# Altium project BPC_PWR_v1.1.PrjPcb (part 4 of 4)
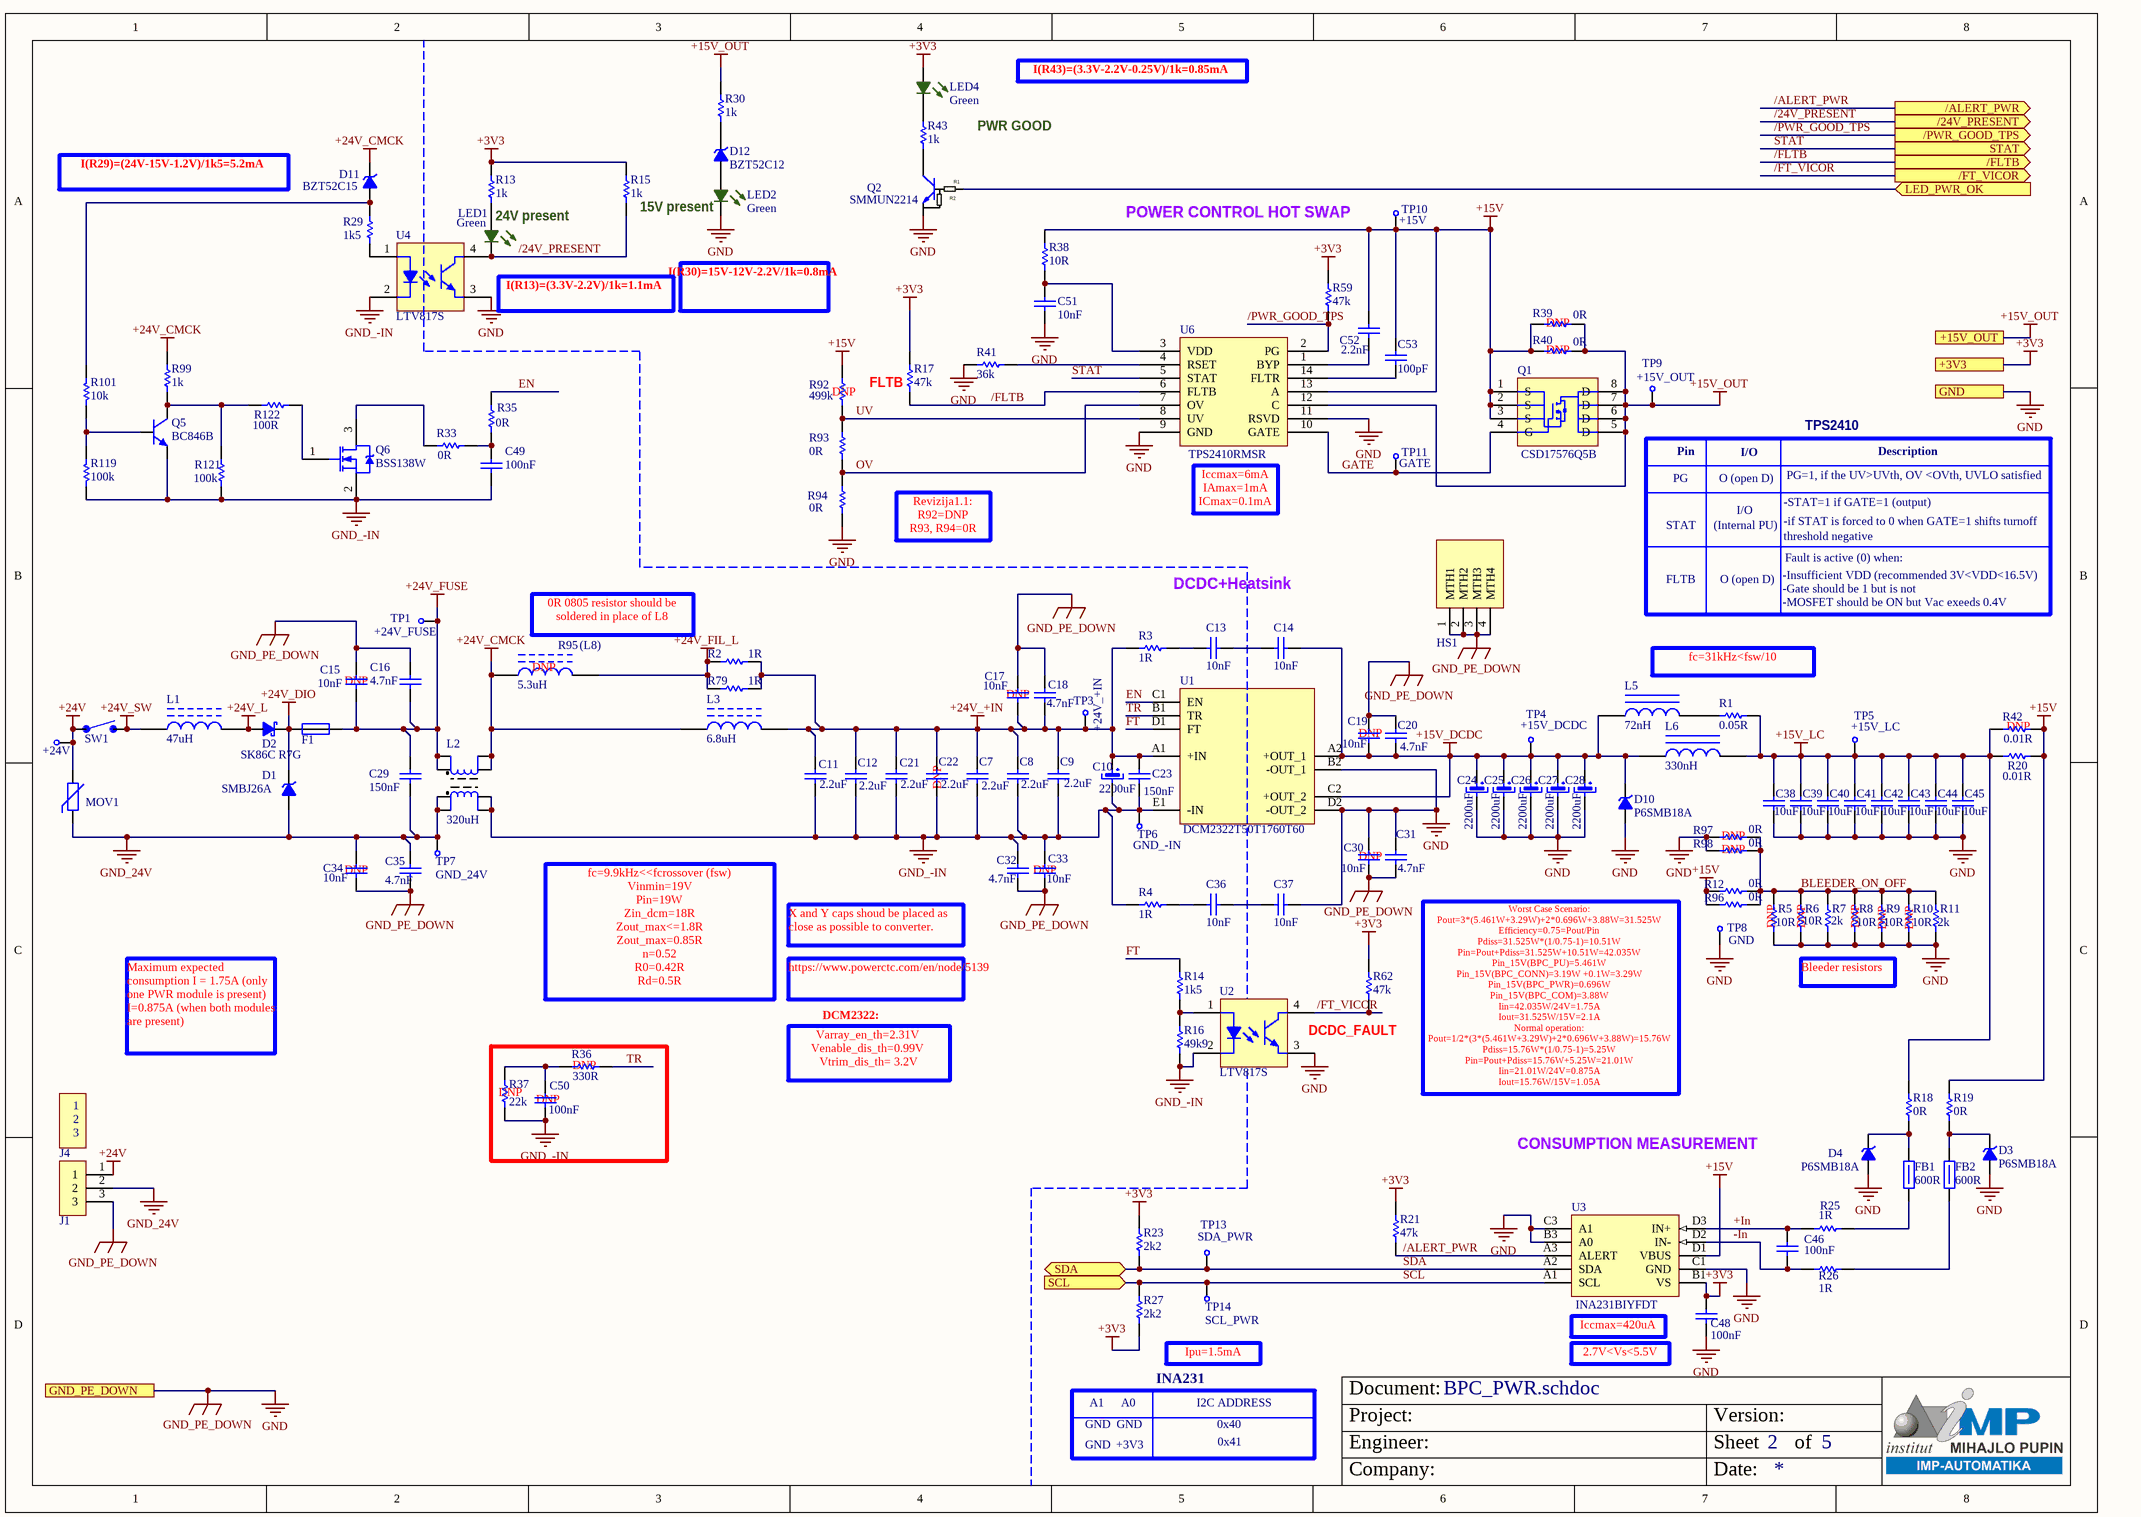
[diagram p7: BPC_PWR.schdoc]

## Sheet BPC_PWR.schdoc: Eurocard VME 6U (9.187 x 6.299 inches) (continued)

### Library data of the parts (continued)
SW1 = El-Mech Switch DF52J12P215HQA MS: Rocker Switch 16A 125V; Manufacturer: C&K; Rated Current: 10AAC, 6ADC; Rated Voltage: 250VAC, 48VDC; Production Status: Active; Distributor: Digi-Key; Distributor Part Number: CKN11830-ND; Manufacturer Part Number: DF52J12P215HQA; Last Revision Date: 01.10.2021; Mounting: Panel mount; ComponentLink1Description: Datasheet; ComponentLink1URL: https://www.ckswitches.com/media/1443/df.pdf; ComponentLink2Description: Distributor; ComponentLink2URL: https://www.digikey.com/en/products/detail/c-k/DF52J12P215HQA/3752604; ComponentLink3Description: Manufacturer; ComponentLink3URL: https://www.ckswitches.com/products/switches/product-details/Rocker/DF/DF52J12P215HQA/; Status: Not Checked; DB Parameter 1: 250VAC, 48VDC; DB Parameter 2: 10AAC, 6ADC
U1 = DC/DC 24V:15V 50W DCM2322T50T1760T60 MS: Isolated Module DC DC Converter 1 Output 15V  4A  9V - 50V Input; Manufacturer: Vicor Corporation; Input Voltage: 9V ~ 50V; Production Status: Active; Isolation: 3V; Distributor: Digi-Key; Distributor Part Number: 1102-DCM2322T50T1760T60-ND; Last Revision Date: 09.03.2021; Temperature Range: -40°C ~ +125°C; Mounting: TH; ComponentLink1Description: Datasheet; ComponentLink1URL: http://www.vicorpower.com/documents/datasheets/DCM2322x50T1760y6z_ds.pdf; ComponentLink2Description: Distributor; ComponentLink2URL: https://www.digikey.com/en/products/detail/vicor-corporation/DCM2322T50T1760T60/10413813; ComponentLink3Description: Manufacturer; ComponentLink3URL: http://www.vicorpower.com/products?productType=cfg&productKey=DCM2322T50T1760T60; Status: Not Checked; Output Voltage: 15V; DB Parameter 1: DCM2322T50T1760T60; DB Parameter 2: 4A; DB Parameter 3: 15V; Output Current: 4A; Manufacturer Part Number: DCM2322T50T1760T60
U2 U4 = IC LTV817S: Optocoupler 5KV Transistor 4-SMD; Manufacturer: Lite-On Inc.; Manufacturer Part Number: LTV-817S; Isolation Voltage: 5000 Vrms; Forward Voltage: 1.2V; Max Forward Current: 50mA; Max Output Voltage: 35V; DB Parameter 3: 4us; Production status: Active; Distributor: Digi-Key; Distributor Part Number: 160-1367-5-ND; Last Revision Date: 17.03.2021; Temperature Range: -30°C ~ +110°C; Mounting: SMD; ComponentLink1Description: Datasheet; ComponentLink1URL: https://optoelectronics.liteon.com/upload/download/DS-70-96-0016/LTV-8X7%20series%20201610%20.pdf; ComponentLink2Description: Distributor; ComponentLink2URL: https://www.digikey.com/en/products/detail/lite-on-inc/LTV-817S/385837; ComponentLink3Description: Manufacturer; ComponentLink3URL: https://optoelectronics.liteon.com/upload/download/DS-70-96-0016/LTV-8X7%20series%20201610%20.pdf; Status: Not Checked; DB Parameter 1: 1.2V; DB Parameter 2: 5000 Vrms; Rise/Fall time: 4us
U3 = IC INA231BIYFDT MS: IC MONITOR PWR/CURR BIDIR 10MSOP; Manufacturer: Texas Instruments; Power Supply: 2.7V ~ 5.5V; DB Parameter 1: 0V ~ 36V; Production Status: Active; Sense Voltage: 0V ~ 25V; Distributor: Mouser; Distributor Part Number: 595-INA231BIYFDT; Last Revision Date: 26.07.2021; Temperature Range: -40°C ~ +125°C; Mounting: SMD; ComponentLink1Description: Datasheet; ComponentLink1URL: https://www.ti.com/lit/ds/symlink/ina231.pdf?HQS=dis-mous-null-mousermode-dsf-pf-null-wwe&DCM=yes&ref_url=https%3A%2F%2Feu.mouser.com%2F&distId=26; ComponentLink2Description: Distributor; ComponentLink2URL: https://eu.mouser.com/ProductDetail/Texas-Instruments/INA231BIYFDT?qs=%2Fha2pyFadui7MHIC05DHFvKEuHw3A34T1OGTYifc7galKUOlGM%2FqWQ%3D%3D; ComponentLink3Description: Manufacturer; ComponentLink3URL: https://www.ti.com/product/INA231?keyMatch=INA231BIYFDT&tisearch=search-everything; Status: Not Checked; Manufacturer Part Number: INA231BIYFDT
U6 = IC TPS2410RMSR MS: IC OR CTRLR N+1 UQFN; Manufacturer: Texas Instruments; Power Supply: 3V~16.5V; Production Status: Active; Distributor: Mouser; Distributor Part Number: 595-TPS2410RMSR; Last Revision Date: 26.07.2021; Temperature Range: -40°C ~ +85°C; Mounting: SMD; ComponentLink1Description: Datasheet; ComponentLink1URL: https://www.ti.com/lit/ds/symlink/tps2410.pdf?ts=1627292155251&ref_url=https%253A%252F%252Fwww.ti.com%252Fproduct%252FTPS2410; ComponentLink2Description: Distributor; ComponentLink2URL: https://eu.mouser.com/ProductDetail/Texas-Instruments/TPS2410RMSR?qs=d0WKAl%252BL4KZPBEcdojYg8Q%3D%3D; ComponentLink3Description: Manufacturer; ComponentLink3URL: https://www.ti.com/product/TPS2410?keyMatch=TPS2410&tisearch=search-everything; Status: Not Checked; DB Parameter 1: TPS2410RMSR; DB Parameter 2: 3V~16.5V; Manufacturer Part Number: TPS2410RMSR

## Sheet BPC_PWR_CONN.schdoc: Eurocard VME 6U (9.187 x 6.299 inches)
size A3; Organization: Organization; Address1: Address1; Address2: Address2; Address3: Address3; Address4: Address4; DocumentNumber: 1; Revision: 0; SheetNumber: 3; SheetTotal: 5
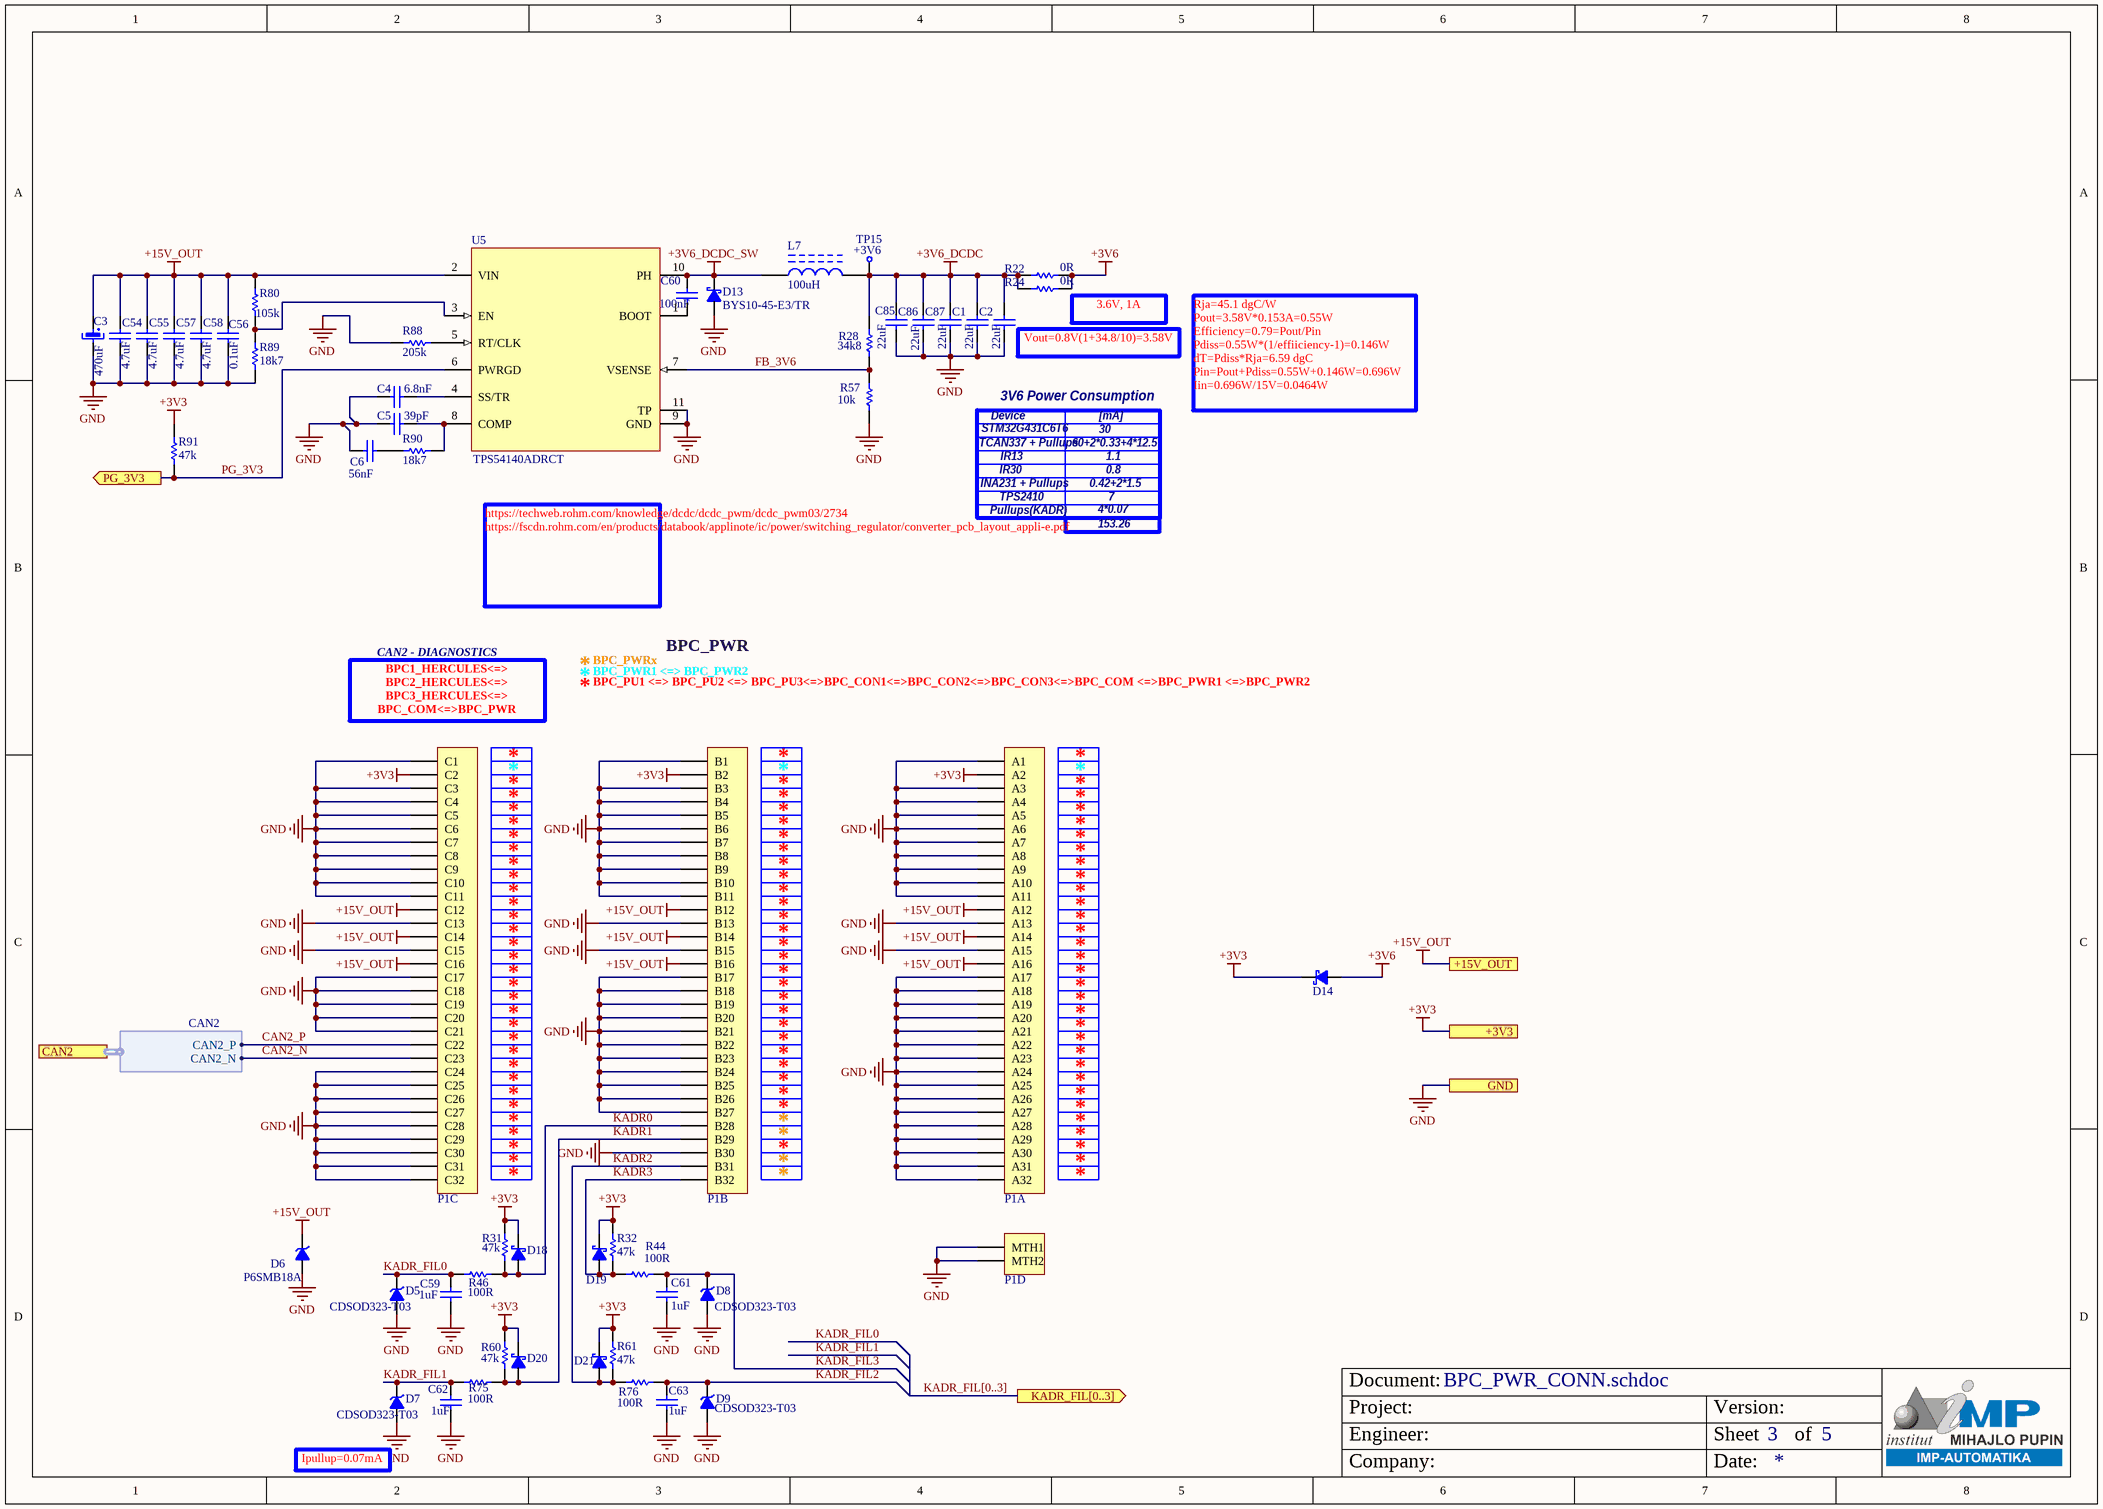
[diagram p4: BPC_PWR_CONN.schdoc]

### Parts
C1  DB Parameter 1: 22uF  [1206 C 1.80mm MS]  (hidden comment: Ceramic Capacitor)
C2  DB Parameter 1: 22uF  [1206 C 1.80mm MS]  (hidden comment: Ceramic Capacitor)
C3  Capacitance: 470uF  [Electrolytic Cap SMD 10x10mm Wuerth MS]  (hidden comment: Electorlytic Capacitor)
C4  Capacitance: 6.8nF  [C0603L 0.8 MM MS]  (hidden comment: Ceramic Capacitor)
C5  DB Parameter 1: 39pF  [C0603L 0.8 MM MS]  (hidden comment: Ceramic Capacitor)
C6  Capacitance: 56nF  [C0603L 0.8 MM MS]  (hidden comment: Ceramic Capacitor)
C54  DB Parameter 1: 4.7uF  [1210 C 1.80mm MS]  (hidden comment: Ceramic Capacitor)
C55  DB Parameter 1: 4.7uF  [1210 C 1.80mm MS]  (hidden comment: Ceramic Capacitor)
C56  Capacitance: 0.1uF  [0805 C 1.27mm MS]  (hidden comment: Ceramic Capacitor)
C57  DB Parameter 1: 4.7uF  [1210 C 1.80mm MS]  (hidden comment: Ceramic Capacitor)
C58  DB Parameter 1: 4.7uF  [1210 C 1.80mm MS]  (hidden comment: Ceramic Capacitor)
C59  Capacitance: 1uF  [C0603L 0.8 MM MS]  (hidden comment: Ceramic Capacitor)
C60  Capacitance: 100nF  [C0603L 0.8 MM MS]  (hidden comment: Ceramic Capacitor)
C61  Capacitance: 1uF  [C0603L 0.8 MM MS]  (hidden comment: Ceramic Capacitor)
C62  Capacitance: 1uF  [C0603L 0.8 MM MS]  (hidden comment: Ceramic Capacitor)
C63  Capacitance: 1uF  [C0603L 0.8 MM MS]  (hidden comment: Ceramic Capacitor)
C85  DB Parameter 1: 22uF  [1206 C 1.80mm MS]  (hidden comment: Ceramic Capacitor)
C86  DB Parameter 1: 22uF  [1206 C 1.80mm MS]  (hidden comment: Ceramic Capacitor)
C87  DB Parameter 1: 22uF  [1206 C 1.80mm MS]  (hidden comment: Ceramic Capacitor)
D5  CDSOD323-T03  [SOD2513X114N]
D6  P6SMB18A  [DO-214AA SMB MS]
D7  CDSOD323-T03  [SOD2513X114N]
D8  CDSOD323-T03  [SOD2513X114N]
D9  CDSOD323-T03  [SOD2513X114N]
D13  BYS10-45-E3/TR  [DO-214AC SMA MS]
D14  PMEG3010ER,115  [SODFL3517X110N MS]  (value not drawn)
D18  PMEG3010ER,115  [SODFL3517X110N MS]  (value not drawn)
D19  PMEG3010ER,115  [SODFL3517X110N MS]  (value not drawn)
D20  PMEG3010ER,115  [SODFL3517X110N MS]  (value not drawn)
D21  PMEG3010ER,115  [SODFL3517X110N MS]  (value not drawn)
L7  Inductance: 100uH  [INDPM120120X1020N MS]  (hidden comment: Inductor)
P1  DIN 41612  [DIN 41612 96-pin Male Angled ABC MS]  (value not drawn)  (parts A,B,C,D of 4)
R22  Resistance: 0R  [R0603L 0.45MM MS]  (hidden comment: Resistor)
R24  Resistance: 0R  [R0603L 0.45MM MS]  (hidden comment: Resistor)
R28  Resistance: 34k8  [R0603L 0.45MM MS]  (hidden comment: Resistor)
R31  Resistance: 47k  [R0603L 0.45MM MS]  (hidden comment: Resistor)
R32  Resistance: 47k  [R0603L 0.45MM MS]  (hidden comment: Resistor)
R44  Resistance: 100R  [R0603L 0.45MM MS]  (hidden comment: Resistor)
R46  Resistance: 100R  [R0603L 0.45MM MS]  (hidden comment: Resistor)
R57  Resistance: 10k  [R0603L 0.45MM MS]  (hidden comment: Resistor)
R60  Resistance: 47k  [R0603L 0.45MM MS]  (hidden comment: Resistor)
R61  Resistance: 47k  [R0603L 0.45MM MS]  (hidden comment: Resistor)
R75  Resistance: 100R  [R0603L 0.45MM MS]  (hidden comment: Resistor)
R76  Resistance: 100R  [R0603L 0.45MM MS]  (hidden comment: Resistor)
R80  Resistance: 105k  [R0603L 0.45MM MS]  (hidden comment: Resistor)
R88  Resistance: 205k  [R0603L 0.45MM MS]  (hidden comment: Resistor)
R89  Resistance: 18k7  [R0603L 0.45MM MS]  (hidden comment: Resistor)
R90  Resistance: 18k7  [R0603L 0.45MM MS]  (hidden comment: Resistor)
R91  Resistance: 47k  [R0603L 0.45MM MS]  (hidden comment: Resistor)
TP15  +3V6  [TP SMD 1.2mm MS]  (no BOM)
U5  TPS54140ADRCT  [DRC10_2P4X1P65_TEX MS]

### Ports
+3V3, +15V_OUT, CAN2 (harness CAN2), GND, KADR_FIL[0..3] (out), PG_3V3 (out)

### Harnesses
CAN2: CAN2_N, CAN2_P

### Nets
+3V3: D14.1(K) D18.1(K) D19.1(K) D20.1(K) D21.1(K) P1.A2 P1.B2 P1.C2 R31.2 R32.2 R60.2 R61.2 R91.2 ; port +3V3
+3V6: D14.2(A) R22.1 R24.1
+3V6_DCDC: C1.1 C2.1 C85.1 C86.1 C87.1 L7.2 R22.2 R24.2 R28.2 TP15.1
+3V6_DCDC_SW: C60.1 D13.1(K) L7.1 U5.10(PH)
+15V_OUT: C3.1 C54.1 C55.1 C56.1 C57.1 C58.1 D6.K P1.A12 P1.A14 P1.A16 P1.B12 P1.B14 P1.B16 P1.C12 P1.C14 P1.C16 R80.2 U5.2(VIN) ; port +15V_OUT
GND: C1.2 C2.2 C3.2 C4.1 C5.1 C6.1 C54.2 C55.2 C56.2 C57.2 C58.2 C59.1 C61.1 C62.2 C63.2 C85.2 C86.2 C87.2 D5.A D6.A D7.A D8.A D9.A D13.2(A) P1.97(MTH1) P1.98(MTH2) P1.A1 P1.A3 P1.A4 P1.A5 P1.A6 P1.A7 P1.A8 P1.A9 P1.A10 P1.A11 P1.A13 P1.A15 P1.A17 P1.A18 P1.A19 P1.A20 P1.A21 P1.A22 P1.A23 P1.A24 P1.A25 P1.A26 P1.A27 P1.A28 P1.A29 P1.A30 P1.A31 P1.A32 P1.B1 P1.B3 P1.B4 P1.B5 P1.B6 P1.B7 P1.B8 P1.B9 P1.B10 P1.B11 P1.B13 P1.B15 P1.B17 P1.B18 P1.B19 P1.B20 P1.B21 P1.B22 P1.B23 P1.B24 P1.B25 P1.B26 P1.B27 P1.B30 P1.C1 P1.C3 P1.C4 P1.C5 P1.C6 P1.C7 P1.C8 P1.C9 P1.C10 P1.C11 P1.C13 P1.C15 P1.C17 P1.C18 P1.C19 P1.C20 P1.C21 P1.C24 P1.C25 P1.C26 P1.C27 P1.C28 P1.C29 P1.C30 P1.C31 P1.C32 R57.2 R88.1 R89.2 U5.9(GND) U5.11(TP) ; port GND
CAN2_N: P1.C23 ; port CAN2.CAN2_N
CAN2_P: P1.C22 ; port CAN2.CAN2_P
FB_3V6: R28.1 R57.1 U5.7(VSENSE)
KADR0: D18.2(A) P1.B28 R31.1 R46.2
KADR1: D20.2(A) P1.B29 R60.1 R75.2
KADR2: D21.2(A) P1.B31 R61.1 R76.1
KADR3: D19.2(A) P1.B32 R32.1 R44.1
KADR_FIL0: C59.2 D5.K R46.1
KADR_FIL1: C62.1 D7.K R75.1
KADR_FIL2: C63.1 D9.K R76.2
KADR_FIL3: C61.2 D8.K R44.2
PG_3V3: R91.1 U5.6(PWRGD) ; port PG_3V3
NetC4_2: C4.2 U5.4(SS/TR)
NetC5_2: C5.2 R90.1 U5.8(COMP)
NetC6_2: C6.2 R90.2
NetC60_2: C60.2 U5.1(BOOT)
NetR80_1: R80.1 R89.1 U5.3(EN)
NetR88_2: R88.2 U5.5(RT/CLK)

### Buses and harness runs
bus KADR_FIL[0..3] = port KADR_FIL[0..3]

### Notes on the sheet
- 3.6V, 1A
- (near C2) Vout=0.8V(1+34.8/10)=3.58V
- TCAN337 + Pullups
- STM32G431C6T6
- Device
- 3V6 Power Consumption
- 60+2*0.33+4*12.5
- [mA]
- 30
- Rja=45.1 dgC/W
  Pout=3.58V*0.153A=0.55W
  Efficiency=0.79=Pout/Pin
  Pdiss=0.55W*(1/effiiciency-1)=0.146W
  dT=Pdiss*Rja=6.59 dgC
  Pin=Pout+Pdiss=0.55W+0.146W=0.696W
  Iin=0.696W/15V=0.0464W
- INA231 + Pullups
- Pullups(KADR)
- IR30
- TPS2410
- IR13
- 0.42+2*1.5
- 4*0.07
- 1.1
- 0.8
- 7
- 153.26
- https://techweb.rohm.com/knowledge/dcdc/dcdc_pwm/dcdc_pwm03/2734
  https://fscdn.rohm.com/en/products/databook/applinote/ic/power/switching_regulator/converter_pcb_layout_appli-e.pdf
- BPC_PWR
- (near P1) BPC1_HERCULES<=>
  BPC2_HERCULES<=>
  BPC3_HERCULES<=>
  BPC_COM<=>BPC_PWR
  BPC2<=>BPC3<=>BPC_COM<=> BPC_PWR
- CAN2 - DIAGNOSTICS
- *
- BPC_PWR1 <=> BPC_PWR2
- BPC_PU1 <=> BPC_PU2 <=> BPC_PU3<=>BPC_CON1<=>BPC_CON2<=>BPC_CON3<=>BPC_COM <=>BPC_PWR1 <=>BPC_PWR2
- BPC_PWRx
- (near D7) Ipullup=0.07mA
- Document:
- Project:
- Engineer:
- Version:
- Sheet
- of
- Company:
- Date:

### Library data of the parts
C1 C2 C85-C87 = Cap Cer 22uF 10V X7R 1206 MS: Ceramic Capacitor 22UF 10V X7R 1206; Manufacturer: Samsung Electro-Mechanics; Manufacturer Part Number: CL31B226MPHNNNE; Tolerance: ±20%; Production Status: Active; Distributor: Digi-Key; Distributor Part Number: 1276-3148-1-ND; Last Revision Date: 07.04.2021; Temperature Range: -55°C ~ +125°C; Mounting: SMD; ComponentLink1Description: Datasheet; ComponentLink1URL: http://weblib.samsungsem.com/mlcc/mlcc-ec-data-sheet.do?partNumber=CL31B226MPHNNN; ComponentLink2Description: Distributor; ComponentLink2URL: https://www.digikey.com/en/products/detail/samsung-electro-mechanics/CL31B226MPHNNNE/3888806; ComponentLink3Description: Manufacturer; ComponentLink3URL: http://product.samsungsem.com/mlcc/basic-search.do?partNumber=CL31B226MPHNNN; Status: Not Checked; Voltage: 10V; Dielectric: X7R; ComponentLink4Description: Charts; ComponentLink4URL: http://weblib.samsungsem.com/mlcc/mlcc-ec-data-sheet.do?partNumber=CL31B226MPHNNN; Capacitance: 22uF; DB Parameter 2: 10V; DB Parameter 3: X7R
C3 = Cap El 470uF 25V 10x10mm Nichicon MS: Electrolytic Capacitor 470uF 25V 10x10mm; Manufacturer Part Number: UCL1E471MNL1GS; Tolerance: ±20%; ESR: 60mOhm; Ripple Current: 1.19A @ 120KHz; Production Status: Active; Distributor: Digi-Key; Distributor Part Number: 493-3944-1-ND; Manufacturer: Nichicon; Last Revision Date: 18.10.2021; Temperature Range: -55°C ~ +105°C; Part ID: https://products.nichicon.co.jp/en/product_detail.cfm; Mounting: SMD; ComponentLink1Description: Datasheet; ComponentLink1URL: https://www.nichicon.co.jp/english/products/pdfs/e-ucl.pdf; ComponentLink2Description: Distributor; ComponentLink2URL: https://www.digikey.com/en/products/detail/nichicon/UCL1E471MNL1GS/2300293; ComponentLink3Description: Manufacturer; Status: Not Checked; Voltage: 25V; DB Parameter 1: 470uF; DB Parameter 2: 25V; DB Parameter 3: 60mOhm
C4 = Cap Cer 6.8nF 50V X7R 0603 MS: Ceramic Capacitor 6.8nF 50V X7R 0603; Manufacturer: Samsung Electro-Mechanics; Manufacturer Part Number: CL10B682KB8WPNC; Tolerance: ±10%; Distributor: Mouser; Distributor Part Number: 187-CL10B682KB8WPNC; Last Revision Date: 16.11.2021; Temperature Range: -55°C ~ +125°C; Mounting: SMD; ComponentLink1Description: Datasheet; ComponentLink1URL: http://weblib.samsungsem.com/mlcc/mlcc-ec-data-sheet.do?partNumber=CL10B682KB8WPN; ComponentLink2Description: Distributor; ComponentLink2URL: https://eu.mouser.com/ProductDetail/Samsung-Electro-Mechanics/CL10B682KB8WPNC?qs=%2Fha2pyFadug1twFwk2Wnk2Vt7E8v7A45fe06n%2FQrFB9HdtGBEQp1bw%3D%3D; ComponentLink3Description: Manufacturer; ComponentLink3URL: http://product.samsungsem.com/mlcc/CL10B682KB8WPN.do; Status: Not Checked; Voltage: 50V; Dielectric: X7R; ComponentLink4Description: Charts; ComponentLink4URL: http://weblib.samsungsem.com/mlcc/mlcc-ec-data-sheet.do?partNumber=CL10B682KB8WPN; DB Parameter 1: 6.8nF; DB Parameter 2: 50V; DB Parameter 3: X7R
C5 = Cap Cer 39pF 50V C0G_NP0 0603: Ceramic Capacitor 39pF 50V C0G_NP0 0603; Manufacturer: Yageo; Manufacturer Part Number: CC0603JRNPO9BN390; Tolerance: ±5%; Production Status: Active; Distributor: Mouser; Distributor Part Number: 603-CC603JRNPO9BN390; Last Revision Date: 02.12.2021; Temperature Range: -55°C ~ +125°C; Mounting: SMD; ComponentLink1Description: Datasheet; ComponentLink1URL: https://www.yageo.com/upload/media/product/productsearch/datasheet/mlcc/UPY-GP_NP0_16V-to-50V_18.pdf; ComponentLink2Description: Distributor; ComponentLink2URL: https://eu.mouser.com/ProductDetail/YAGEO/CC0603JRNPO9BN390?qs=T%2F3nPWKqOSYu51Zx7Vtd2Q%3D%3D; ComponentLink3Description: Manufacturer; ComponentLink3URL: https://www.yageo.com/en/ProductSearch/PartNumberSearch?part_number=CC0603JRNPO9BN390; Status: Not Checked; Voltage: 50V; Dielectric: C0G_NP0; ComponentLink4Description: Charts; ComponentLink4URL: https://www.yageo.com/en/Chart/Index/CC0603JRNPO9BN390; Capacitance: 39pF; DB Parameter 2: 50V; DB Parameter 3: C0G_NP0
C6 = Cap Cer 56nF 50V X7R 0603 MS: Ceramic Capacitor 56nF 50V X7R 0603; Manufacturer: Yageo; Manufacturer Part Number: CC0603KRX7R9BB563; Tolerance: ±10%; Production Status: Active; Distributor: Mouser; Distributor Part Number: 603-CC603KRX7R9BB563; Last Revision Date: 12.02.2021; Temperature Range: -55°C ~ +125°C; Mounting: SMD; ComponentLink1Description: Datasheet; ComponentLink1URL: https://www.yageo.com/upload/media/product/productsearch/datasheet/mlcc/UPY-GPHC_X7R_6.3V-to-50V_20.pdf; ComponentLink2Description: Distributor; ComponentLink2URL: https://eu.mouser.com/ProductDetail/YAGEO/CC0603KRX7R9BB563?qs=57cj7OiSijmLSlNkQYflZA%3D%3D; ComponentLink3Description: Manufacturer; ComponentLink3URL: https://www.yageo.com/en/ProductSearch/PartNumberSearch?part_number=CC0603KRX7R9BB563; Status: Not Checked; Voltage: 50V; Dielectric: X7R; ComponentLink4Description: Charts; ComponentLink4URL: https://www.yageo.com/en/Chart/Index/CC0603KRX7R9BB563; DB Parameter 1: 56nF; DB Parameter 2: 50V; DB Parameter 3: X7R
C54 C55 C57 C58 = Cap Cer 4.7uF 100V X7S 1210 MS: Ceramic Capacitor 4.7uF 100V X7S 1210; Manufacturer: Taiyo Yuden; Manufacturer Part Number: HMK325C7475KN-TE; Tolerance: ±10%; Production Status: Active; Distributor: Digi_Key; Distributor Part Number: 587-5038-1-ND; Last Revision Date: 22.07.2021; Temperature Range: -55°C ~ +125°C; Mounting: SMD; ComponentLink1Description: Datasheet; ComponentLink1URL: https://www.yuden.co.jp/productdata/catalog/mlcc06_e.pdf; ComponentLink2Description: Distributor; ComponentLink2URL: https://www.digikey.com/en/products/detail/taiyo-yuden/HMK325C7475KN-TE/6563631; ComponentLink3Description: Manufacturer; ComponentLink3URL: https://ds.yuden.co.jp/TYCOMPAS/ut/detail?pn=HMK325C7475KN-TE&u=M; Status: Not Checked; Voltage: 100V; Dielectric: X7S; ComponentLink4Description: Charts; ComponentLink4URL: https://ds.yuden.co.jp/TYCOMPAS/ut/detail?pn=HMK325C7475KN-TE&u=M; Capacitance: 4.7uF; DB Parameter 2: 100V; DB Parameter 3: X7S
C56 = Cap Cer 0.1uF 100V X7R 0805 MS: Ceramic Capacitor 0.1uF 100V X7R 0805; Manufacturer: TDK; Manufacturer Part Number: C2012X7R2A104K125AA; Tolerance: ±10%; Production Status: Active; Distributor: Mouser; Distributor Part Number: 810-C2012X7R2A104K; Last Revision Date: 06.12.2021; Temperature Range: -55°C ~ +125°C; Mounting: SMD; ComponentLink1Description: Datasheet; ComponentLink1URL: https://product.tdk.com/system/files/dam/doc/product/capacitor/ceramic/mlcc/catalog/mlcc_commercial_midvoltage_en.pdf; ComponentLink2Description: Distributor; ComponentLink2URL: https://eu.mouser.com/ProductDetail/TDK/C2012X7R2A104K125AA?qs=NRhsANhppD9J0ZsT2%2Fo%2F7Q%3D%3D; ComponentLink3Description: Manufacturer; ComponentLink3URL: https://product.tdk.com/en/search/list#part_no=C2012X7R2A104K125AA&_l=20&_p=1&_c=part_no-part_no&_d=0; Status: Not Checked; Voltage: 100V; Dielectric: X7R; ComponentLink4Description: Charts; ComponentLink4URL: https://product.tdk.com/system/files/dam/doc/product/capacitor/ceramic/mlcc/charasheet/c2012x7r2a104k125aa.pdf; DB Parameter 1: 0.1uF; DB Parameter 2: 100V; DB Parameter 3: X7R
C59 C61-C63 = Cap Cer 1uF 50V X5R 0603 MS: Ceramic Capacitor 1uF 50V X5R 0603; Manufacturer: Taiyo Yuden; Manufacturer Part Number: UMK107BJ105KA-T; Tolerance: ±10%; Production Status: Active; Distributor: Digi-Key; Distributor Part Number: 587-2400-1-ND; Last Revision Date: 07.04.2021; Temperature Range: -55°C ~ +85°C; Mounting: SMD; ComponentLink1Description: Datasheet; ComponentLink1URL: https://ds.yuden.co.jp/TYCOMPAS/ut/detail?pn=UMK107BJ105KA-T%20%20&u=M; ComponentLink2Description: Distributor; ComponentLink2URL: https://www.digikey.com/en/products/detail/taiyo-yuden/UMK107BJ105KA-T/2178919; ComponentLink3Description: Manufacturer; ComponentLink3URL: https://ds.yuden.co.jp/TYCOMPAS/ut/detail?pn=UMK107BJ105KA-T%20%20&u=M; Status: Not Checked; Voltage: 50V; Dielectric: X5R; ComponentLink4Description: Charts; ComponentLink4URL: https://ds.yuden.co.jp/TYCOMPAS/ut/detail?pn=UMK107BJ105KA-T%20%20&u=M; DB Parameter 1: 1uF; DB Parameter 2: 50V; DB Parameter 3: X5R
C60 = Cap Cer 100nF 50V X7R 0603 Pt02: Ceramic Capacitor 100nF 50V X7R 0603; Manufacturer: Samsung Electro-Mechanics; Manufacturer Part Number: CL10B104KB8WPNC; Tolerance: ±10%; Distributor: Mouser; Distributor Part Number: 187-CL10B104KB8WPNC; Last Revision Date: 19.10.2020.; Temperature Range: -55°C ~ +125°C; Mounting: SMD; ComponentLink1Description: Datasheet; ComponentLink1URL: https://eu.mouser.com/datasheet/2/396/mlcc02_e-1307760.pdf; ComponentLink2Description: Distributor; ComponentLink2URL: https://eu.mouser.com/ProductDetail/Taiyo-Yuden/JMK212BJ476MG-T?qs=I6KAKw0tg2zBfYZ1Prs1hQ%3D%3D; ComponentLink3Description: Manufacturer; ComponentLink3URL: https://ds.yuden.co.jp/TYCOMPAS/or/detail?pn=JMK212BBJ476MG-T&u=M; Status: Not Checked; Voltage: 50V; Dielectric: X7R; ComponentLink4Description: Charts; DB Parameter 1: 100nF; DB Parameter 2: 50V; DB Parameter 3: X7R
D5 D7-D9 = Dio TVS Udir 3.3V 19V CDSOD323 MS: TVS Diode 3.3V 19V Udir; Manufacturer: Bourns Inc.; Peak Pulse Power: 350W; Production status: Active; Distributor: Digi-Key; Distributor Part Number: CDSOD323-T03CT-ND; Manufacturer Part Number: CDSOD323-T03; Last Revision Date: 29.03.2021; Temperature Range: -55°C ~ +155°C; Mounting: SMD; ComponentLink1Description: Datasheet; ComponentLink1URL: https://www.bourns.com/docs/Product-Datasheets/CDSOD323-TxxC.pdf; ComponentLink2Description: Distributor; ComponentLink2URL: https://www.digikey.com/en/products/detail/bourns-inc/CDSOD323-T03/3742076; ComponentLink3Description: Manufacturer; ComponentLink3URL: https://www.bourns.com/docs/Product-Datasheets/CDSOD323-TxxC.pdf; Status: Not Checked; Working Voltage: 3.3V; DB Parameter 1: 3.3V; DB Parameter 2: 19V; DB Parameter 3: 350W; Clamping Voltage: 19V
D6 = Dio TVS Udir 15.3V 600W P6SMB18A MS: TVS Diode 15.3V 600W Unidirectional; Manufacturer: Bourns; DB Parameter 2: 25.5V; Production status: Active; Distributor: Digi-Key; Distributor Part Number: P6SMB18ABBCT-ND; Manufacturer Part Number: P6SMB18A; Last Revision Date: 26.03.2021; Temperature Range: -55°C ~ +150°C; Mounting: SMD; ComponentLink1Description: Datasheet; ComponentLink1URL: https://www.bourns.com/docs/Product-Datasheets/P6SMB.pdf; ComponentLink2Description: Distributor; ComponentLink2URL: https://www.digikey.com/en/products/detail/bourns-inc/P6SMB18A/5320280; ComponentLink3Description: Manufacturer; ComponentLink3URL: https://www.bourns.com/docs/Product-Datasheets/P6SMB.pdf; Status: Not Checked; Working Voltage: 15.3V; Peak Pulse Power: 600W; DB Parameter 1: 15.3V; DB Parameter 3: 600W; Clamping Voltage: 25.5V
D13 = Dio Sch 1.5A 45V SMA MS: Schottky Diode 1.5A 45V SMA; Manufacturer: Vishay General Semiconductor; Forward Voltage: 0.5V; Production status: Active; Distributor: Mouser; Distributor Part Number: 625-BYS10-45-E3; Manufacturer Part Number: BYS10-45-E3/TR; Last Revision Date: 16.11.2021; Temperature Range: -65°C ~ +150°C; Mounting: SMD; ComponentLink1Description: Datasheet; ComponentLink1URL: https://eu.mouser.com/datasheet/2/427/VISH_S_A0010476688_1-2571185.pdf; ComponentLink2Description: Distributor; ComponentLink2URL: https://eu.mouser.com/ProductDetail/Vishay/BYS10-45-E3-TR?qs=sGAEpiMZZMuGN2ig0xo6G%252BqK%252BHngrO2%2F; ComponentLink3Description: Manufacturer; ComponentLink3URL: https://www.vishay.com/product?docid=86013; Status: Not Checked; Rated Current: 1.5A; DB Parameter 1: 0.5V; DB Parameter 2: 1.5A; DB Parameter 3: 45V; Forward current: 1.5A
D14 D18-D21 = Dio Sch 1A 30V SOD-123W-2 MS: Schottky Diode 1A 30V SOD-123W-2; Manufacturer: Nexperia; Forward Voltage: 0.32V; Production status: Active; Distributor: Mouser; Distributor Part Number: 771-PMEG3010ER115; Manufacturer Part Number: PMEG3010ER,115; Last Revision Date: 17.08.2021; Temperature Range: -55°C ~ +150°C; Mounting: SMD; ComponentLink1Description: Datasheet; ComponentLink1URL: https://eu.mouser.com/datasheet/2/916/PMEG3010ER-1600158.pdf; ComponentLink2Description: Distributor; ComponentLink2URL: https://eu.mouser.com/ProductDetail/Nexperia/PMEG3010ER115?qs=LMSg3oBIm%2FjofezKw7ztsw%3D%3D; ComponentLink3Description: Manufacturer; ComponentLink3URL: https://www.nexperia.com/products/diodes/automotive-diodes/automotive-schottky-diodes-and-rectifiers/automotive-medium-power-low-vf-schottky-rectifiers-single-200-ma/PMEG3010ER.html; Status: Not Checked; Rated Current: 1A; DB Parameter 1: 0.32V; DB Parameter 2: 1A; DB Parameter 3: 30V; Forward current: 1A
L7 = Ind 100uH 2.4A MSS1210 MS: Inductor 100uH 2.4A 0.125R; Manufacturer: Coilcraft; Manufacturer Part Number: MSS1210-104KED; Tolerance: ±10%; Saturation Current: 3.4A; Core Material: Ferrite; SRF: 3.6MHz; Distributor: Mouser; Distributor Part Number: 994-MSS1210-104KED; Last Revision Date: 02.12.2021; Temperature Range: -40°C ~ +85°C; Mounting: SMD; ComponentLink1Description: Datasheet; ComponentLink1URL: https://eu.mouser.com/datasheet/2/597/mss1210-270677.pdf; ComponentLink2Description: Distributor; ComponentLink2URL: https://eu.mouser.com/ProductDetail/Coilcraft/MSS1210-104KED?qs=zCSbvcPd3pbNwzTgkTyd0g%3D%3D; ComponentLink3Description: Manufacturer; ComponentLink3URL: https://www.coilcraft.com/en-us/products/power/shielded-inductors/ferrite-drum/mss-mos/mss1210/?skuId=5439|7722; Status: Not Checked; DC Resistance: 0.125R; DB Parameter 1: 100uH; DB Parameter 2: 2.4A; DB Parameter 3: 0.125R; Rated Current: 2.4A
P1 = Con DIN 41612 96-pin Male Angled ABC MS: Connector DIN 41612 96-pin Male C-type; Manufacturer: Assmann WSW; Manufacturer Part Number: A-CM96ABCR; Rated Current: 2A; Parameter 1: CM96RW; Production Status: Active; Distributor: Schukat; Distributor Part Number: F5151 CM96RW; Last Revision Date: 02.08.2021; Temperature Range: -55°C ~ +125°C; Mounting: TH; ComponentLink1Description: Datasheet; ComponentLink1URL: https://www.assmann-wsw.com/uploads/datasheets/ASS_5678_CO.pdf; ComponentLink2Description: Distributor; ComponentLink2URL: https://www.schukat.com/schukat/schukat_cms_en.nsf/index/CMSDF15D356B046D53BC1256D550038A9E0?OpenDocument&wg=F5151&kb=CM96RW#CM96RW; ComponentLink3Description: Manufacturer; ComponentLink3URL: https://www.assmann-wsw.com/en/product/a-cm96abcr/; Status: Not Checked; Parameter 2: 2A
R22 R24 = Res 0R 100mW 0603: Resistor  0R 100mW 0603; Manufacturer: Stackpole Electronics Inc; Manufacturer Part Number: RMCF0603ZT0R00; DB Parameter 2: 1A; Production Status: Active; Maximum Current: 2A; Distributor: Digi-Key; Distributor Part Number: RMCF0603ZT0R00CT-ND; Last Revision Date: 20.10.2020.; Temperature Range: -55°C ~ +155°C; Mounting: SMD; ComponentLink1Description: Datasheet; ComponentLink1URL: https://www.seielect.com/catalog/sei-rmcf_rmcp.pdf; ComponentLink2Description: Distributor; ComponentLink2URL: https://www.digikey.com/en/products/detail/stackpole-electronics-inc/RMCF0603ZT0R00/1756908; ComponentLink3Description: Manufacturer; ComponentLink3URL: https://www.seielect.com/; Status: Not Checked; Power Rating: 100mW; DB Parameter 1: 0R; DB Parameter 3: 100mW; Rated Current: 1A
R28 = Res 34k8 1% 100mW 0603 MS: Resistor 34k8 1% 100mW 0603; Manufacturer: Panasonic; Manufacturer Part Number: ERJ-3EKF3482V; Temperature Coefficient: ±100ppm/°C; Production Status: Active; Distributor: Mouser; Distributor Part Number: 667-ERJ-3EKF3482V; Last Revision Date: 17.11.2021; Temperature Range: -55°C ~ +155°C; Mounting: SMD; ComponentLink1Description: Datasheet; ComponentLink1URL: https://eu.mouser.com/datasheet/2/315/AOA0000C304-1149620.pdf; ComponentLink2Description: Distributor; ComponentLink2URL: https://eu.mouser.com/ProductDetail/Panasonic/ERJ-3EKF3482V?qs=MVjVSMjNRMovR8SjCGcl3g%3D%3D; ComponentLink3Description: Manufacturer; ComponentLink3URL: https://na.industrial.panasonic.com/products/resistors/smd-chip-resistors/lineup/chip-resistors/series/57494/model/66687; Status: Not Checked; Power Rating: 100mW; Tolerance: ±1%; DB Parameter 1: 34k8; DB Parameter 2: ±1%; DB Parameter 3: 100mW
R31 R32 R60 R61 R91 = Res 47k 1% 100mW 0603 MS: Resistor 47k 1% 100mW 0603; Manufacturer: Yageo; Manufacturer Part Number: RT0603FRE0747KL; Temperature Coefficient: ±50ppm/°C; Production Status: Active; Distributor: Digi-Key; Distributor Part Number: YAG3355CT-ND; Last Revision Date: 08.06.2021; Temperature Range: -55°C ~ +155°C; Mounting: SMD; ComponentLink1Description: Datasheet; ComponentLink1URL: https://www.yageo.com/upload/media/product/productsearch/datasheet/rchip/PYu-RT_1-to-0.01_RoHS_L_12.pdf; ComponentLink2Description: Distributor; ComponentLink2URL: https://www.digikey.com/en/products/detail/yageo/RT0603FRE0747KL/1075386; ComponentLink3Description: Manufacturer; ComponentLink3URL: https://www.yageo.com/en/ProductSearch/PartNumberSearch?part_number=RT0603FRE0747KL; Status: Not Checked; Power Rating: 100mW; Tolerance: ±1%; DB Parameter 1: 47k; DB Parameter 2: ±1%; DB Parameter 3: 100mW
R44 R46 R75 R76 = Res 100R 1% 100mW 0603 MS Pt02: Resistor 100R 1% 100mW 0603; Manufacturer: Stackpole Electronics Inc; Manufacturer Part Number: RMCF0603FT100R; Temperature Coefficient: 100ppm/°C; Production Status: Active; Distributor: Digi-Key; Distributor Part Number: RMCF0603FT100RCT-ND; Last Revision Date: 26.07.2021; Temperature Range: -55°C ~ +155°C; Mounting: SMD; ComponentLink1Description: Datasheet; ComponentLink1URL: https://www.seielect.com/catalog/sei-rmcf_rmcp.pdf; ComponentLink2Description: Distributor; ComponentLink2URL: https://www.digikey.com/en/products/detail/stackpole-electronics-inc/RMCF0603FT100R/1761113; ComponentLink3Description: Manufacturer; ComponentLink3URL: https://www.seielect.com/catalog/sei-rmcf_rmcp.pdf; Status: Not Checked; Power Rating: 100mW; Tolerance: ±1%; DB Parameter 1: 100R; DB Parameter 2: ±1%; DB Parameter 3: 100mW
R57 = Res 10k 1% 100mW 0603: Resistor 10k 1% 100mW 0603; Manufacturer: Yageo; Manufacturer Part Number: RC0603FR-1310KL; Temperature Coefficient: ±100 PPM/°C; Production Status: Active; Distributor: Digi-Key; Distributor Part Number: 13-RC0603FR-1310KLCT-ND; Last Revision Date: 26.07.2021; Temperature Range: -55°C ~ +155°C; Mounting: SMD; ComponentLink1Description: Datasheet; ComponentLink1URL: https://www.yageo.com/upload/media/product/productsearch/datasheet/rchip/PYu-RC_Group_51_RoHS_L_11.pdf; ComponentLink2Description: Distributor; ComponentLink2URL: https://www.digikey.com/en/products/detail/yageo/RC0603FR-1310KL/12756399; ComponentLink3Description: Manufacturer; ComponentLink3URL: https://www.yageo.com/en/ProductSearch/PartNumberSearch?part_number=RC0603FR-1310KL; Status: Not Checked; Power Rating: 100mW; Tolerance: ±1%
R80 = Res 105k 1% 100mW 0603: Resistor 105k 1% 100mW 0603; Manufacturer: Panasonic; Manufacturer Part Number: ERJ-3EKF1053V; Temperature Coefficient: ±100ppm/°C; Production Status: Active; Distributor: Mouser; Distributor Part Number: 667-ERJ-3EKF1053V; Last Revision Date: 11.16.2021; Temperature Range: -55°C ~ +155°C; Mounting: SMD; ComponentLink1Description: Datasheet; ComponentLink1URL: https://eu.mouser.com/datasheet/2/315/AOA0000C304-1149620.pdf; ComponentLink2Description: Distributor; ComponentLink2URL: https://eu.mouser.com/ProductDetail/Panasonic/ERJ-3EKF1053V?qs=%2Fha2pyFaduj1bDH1zHognWywlV%252Bfhxn59vdwPsffWraGSXr%252B3q8%252BpA%3D%3D; ComponentLink3Description: Manufacturer; ComponentLink3URL: https://na.industrial.panasonic.com/products/resistors/smd-chip-resistors/lineup/chip-resistors/series/57494/model/66394; Status: Not Checked; Power Rating: 100mW; Tolerance: ±1%; DB Parameter 1: 105k; DB Parameter 2: ±1%; DB Parameter 3: 100mW
R88 = Res 205k 1% 100mW 0603 MS: Resistor 205k 1% 100mW 0603; Manufacturer: Panasonic; Manufacturer Part Number: ERJ-3EKF2053V; Temperature Coefficient: 100ppm/°C; Production Status: Active; Distributor: Mouser; Distributor Part Number: 667-ERJ-3EKF2053V; Last Revision Date: 16.11.2021; Temperature Range: -55°C ~ +155°C; Mounting: SMD; ComponentLink1Description: Datasheet; ComponentLink1URL: https://eu.mouser.com/datasheet/2/315/AOA0000C304-1149620.pdf; ComponentLink2Description: Distributor; ComponentLink2URL: https://eu.mouser.com/ProductDetail/Panasonic/ERJ-3EKF2053V?qs=%2Fha2pyFaduhdoJMZbYKqsn11IM6BeaI8S6g2ThV0RFoa69kjcEtdIA%3D%3D; ComponentLink3Description: Manufacturer; ComponentLink3URL: https://na.industrial.panasonic.com/products/resistors/smd-chip-resistors/lineup/chip-resistors/series/57494/model/66550; Status: Not Checked; Power Rating: 100mW; Tolerance: ±1%; DB Parameter 1: 205k; DB Parameter 2: ±1%; DB Parameter 3: 100mW
R89 R90 = Res 18k7 1% 100mW 0603 MS: Resistor 18k7 1% 100mW 0603; Manufacturer: Panasonic; Manufacturer Part Number: ERJ-3EKF1872V; Temperature Coefficient: ±100ppm/°C; Production Status: Active; Distributor: Mouser; Distributor Part Number: 667-ERJ-3EKF1872V; Last Revision Date: 16.11.2021; Temperature Range: -55°C ~ +155°C; Mounting: SMD; ComponentLink1Description: Datasheet; ComponentLink1URL: https://eu.mouser.com/datasheet/2/315/AOA0000C304-1149620.pdf; ComponentLink2Description: Distributor; ComponentLink2URL: https://eu.mouser.com/ProductDetail/Panasonic/ERJ-3EKF1872V?qs=%2Fha2pyFaduj1bDH1zHognQZ3bncj3JpKbioy8JJi8efwgvHcwvf38A%3D%3D; ComponentLink3Description: Manufacturer; ComponentLink3URL: https://na.industrial.panasonic.com/products/resistors/smd-chip-resistors/lineup/chip-resistors/series/57494/model/66530; Status: Not Checked; Power Rating: 100mW; Tolerance: ±1%; DB Parameter 1: 18k7; DB Parameter 2: ±1%; DB Parameter 3: 100mW
TP15 = Test Point SMD: Test Point SMD 1.2 mm No Via; DB Parameter 2: 1.2mm; DB Parameter 3: SMD No Via; Last Revision Date: 29.01.2018.; Package: N/A; Mounting: N/A; DB Parameter 1: *
U5 = IC TPS54140ADRCT MS: IC REG BUCK ADJ 1.5A 10VSON; Manufacturer: Texas Instruments; Input Voltage: 3.5V ~ 42V; VFB: 0.8V; Production Status: Active; Output Current: 2A; Distributor: Digi-Key; Distributor Part Number: 296-30506-1-ND; Last Revision Date: 15.11.2021; Temperature Range: -40°C ~ +150°C; Mounting: SMD; ComponentLink1Description: Datasheet; ComponentLink1URL: https://www.ti.com/lit/ds/symlink/tps54140a.pdf?ts=1636910813422&ref_url=https%253A%252F%252Fwww.google.com%252F; ComponentLink2Description: Distributor; ComponentLink2URL: https://www.digikey.com/en/products/detail/texas-instruments/TPS54140ADRCT/3451631; ComponentLink3Description: Manufacturer; ComponentLink3URL: https://www.ti.com/product/TPS54140A#reference-designs; Status: Not Checked; Output Voltage: ADJ; DB Parameter 1: ADJ; DB Parameter 2: 1.5A; Isolation: N/A; Manufacturer Part Number: TPS54140ADRCT

## Nets that join several sheets
+3V3: BPC_PWR_MCU (26 pins), BPC_PWR_Temp_Sensor (7 pins), BPC_PWR (11 pins), BPC_PWR_CONN (13 pins)
+15V_OUT: BPC_PWR (9 pins), BPC_PWR_CONN (18 pins)
GND: BPC_PWR_TOP (HW1.0 HW2.0), BPC_PWR_MCU (36 pins), BPC_PWR_Temp_Sensor (9 pins), BPC_PWR (61 pins), BPC_PWR_CONN (109 pins)
/24V_PRESENT: BPC_PWR_MCU (U7.9), BPC_PWR (LED1.K R15.2 U4.4)
/ALERT_PWR: BPC_PWR_MCU (U7.8), BPC_PWR (R21.1 U3.A3)
/FLTB: BPC_PWR_MCU (U7.12), BPC_PWR (R17.1 U6.6)
/FT_VICOR: BPC_PWR_MCU (U7.13), BPC_PWR (R62.1 U2.4)
/PWR_GOOD_TPS: BPC_PWR_MCU (U7.10), BPC_PWR (R59.1 U6.2)
CAN2_N: BPC_PWR_MCU (D17.1 R86.1 R87.1 U9.6), BPC_PWR_CONN (P1.C23)
CAN2_P: BPC_PWR_MCU (D16.1 R84.2 R85.2 U9.7), BPC_PWR_CONN (P1.C22)
KADR_FIL0: BPC_PWR_MCU (U7.32), BPC_PWR_CONN (C59.2 D5.K R46.1)
KADR_FIL1: BPC_PWR_MCU (U7.30), BPC_PWR_CONN (C62.1 D7.K R75.1)
KADR_FIL2: BPC_PWR_MCU (U7.15), BPC_PWR_CONN (C63.1 D9.K R76.2)
KADR_FIL3: BPC_PWR_MCU (U7.31), BPC_PWR_CONN (C61.2 D8.K R44.2)
LED_PWR_OK: BPC_PWR_MCU (U7.41), BPC_PWR (Q2.1)
nTEMP_ALERT: BPC_PWR_MCU (U7.46), BPC_PWR_Temp_Sensor (RT2.1 UT2.3)
PG_3V3: BPC_PWR_MCU (U7.14), BPC_PWR_CONN (R91.1 U5.6)
SCL: BPC_PWR_MCU (U7.39), BPC_PWR_Temp_Sensor (UT2.2), BPC_PWR (R27.1 TP14.1 U3.A1)
SDA: BPC_PWR_MCU (U7.44), BPC_PWR_Temp_Sensor (UT2.1), BPC_PWR (R23.1 TP13.1 U3.A2)
STAT: BPC_PWR_MCU (U7.11), BPC_PWR (U6.5)
TEMP_ANALOG_SENSOR: BPC_PWR_MCU (U7.26), BPC_PWR_Temp_Sensor (CT2.2 RT1.1)

## Assembly variants
Variant of BPC_PWR_v1.1: not fitted C15 C17 C19 C22 C30 C33 C34 C50 C73 C74 C78 C79 C80 C81 C82 C84 CT1 CT2 HW1 HW2 J2 P2 R5 R6 R8 R9 R10 R36 R37 R39 R40 R42 R78 R81 R84 R85 R86 R87 R92 R97 R98 RT1 RT2 SW2 U8 UT1 Y2